# Altium schematic sheet MAIN_SCH.SchDoc
size A; Engineer: IBRAR AHMAD; Organization: REVIVE MEDICAL TECHNOLOGY; SheetNumber: 1; SheetTotal: 2; PROJECT: CTTM_V1.0
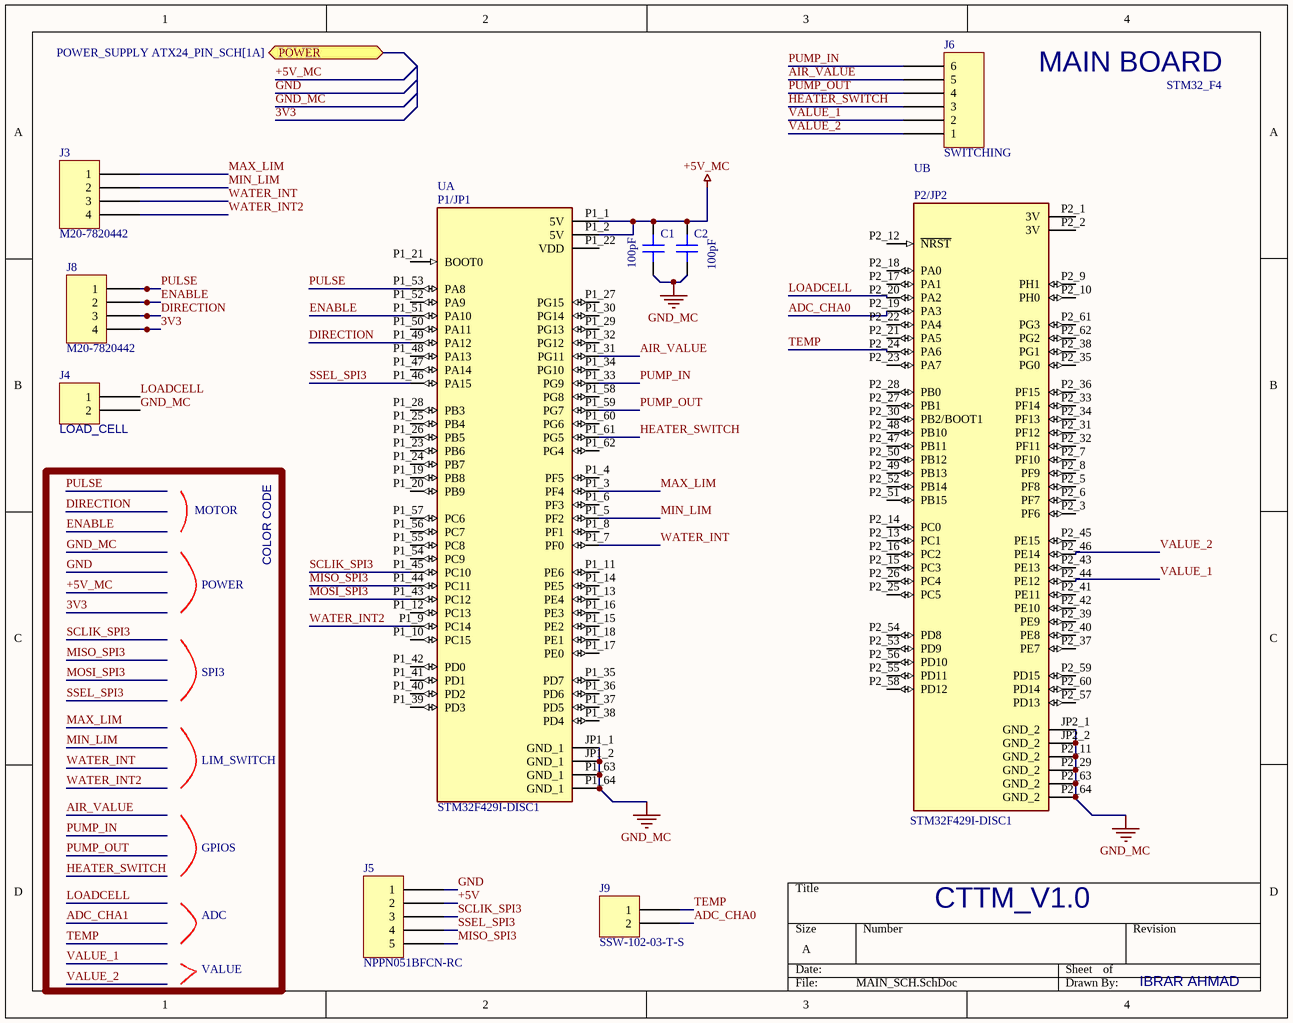
[diagram p0: MAIN_SCH.SchDoc]

## Parts
C1  100pF  [CAP 1206_3216 - 0.8MM]
C2  100pF  [CAP 1206_3216 - 0.8MM]
J3  M20-7820442  [HARWIN M20-7820445]
J4  LOAD_CELL  [SAMTEC SSW-102-03-T-S]
J5  NPPN051BFCN-RC  [SULLINS NPPN051BFCN]
J6  SWITCHING  [MOLEX KK 0022272061]
J8  M20-7820442  [HARWIN M20-7820445]
J9  SSW-102-03-T-S  [SAMTEC SSW-102-03-T-S]
U  STM32F429I-DISC1  [MODULE_STM32F429I-DISC1]  (parts A,B of 2)

## Ports
POWER (bidir, see POWER_SUPPLY ATX24_PIN_SCH[1A])

## Nets
+5V_MC: C1.2 C2.2 U.P1_1(5V) U.P1_2(5V)
GND_MC: C1.1 C2.1 J4.2 U.JP1_1(GND_1) U.JP1_2(GND_1) U.JP2_1(GND_2) U.JP2_2(GND_2) U.P1_63(GND_1) U.P1_64(GND_1) U.P2_11(GND_2) U.P2_29(GND_2) U.P2_63(GND_2) U.P2_64(GND_2)
3V3: J8.4
+5V: J5.2
ADC_CHA0: J9.2 U.P2_19(PA3)
AIR_VALUE: J6.5 U.P1_31(PG11)
DIRECTION: J8.3 U.P1_49(PA12)
ENABLE: J8.2 U.P1_51(PA10)
GND: J5.1
HEATER_SWITCH: J6.3 U.P1_61(PG5)
LOADCELL: J4.1 U.P2_20(PA2)
MAX_LIM: J3.1 U.P1_3(PF4)
MIN_LIM: J3.2 U.P1_5(PF2)
MISO_SPI3: J5.5 U.P1_44(PC11)
MOSI_SPI3: U.P1_43(PC12)
PULSE: J8.1 U.P1_53(PA8)
PUMP_IN: J6.6 U.P1_33(PG9)
PUMP_OUT: J6.4 U.P1_59(PG7)
SCLIK_SPI3: J5.3 U.P1_45(PC10)
SSEL_SPI3: J5.4 U.P1_46(PA15)
TEMP: J9.1 U.P2_24(PA6)
VALUE_1: J6.2 U.P2_44(PE12)
VALUE_2: J6.1 U.P2_46(PE14)
WATER_INT: J3.3 U.P1_7(PF0)
WATER_INT2: J3.4 U.P1_9(PC14)

Not connected (* = marked no-connect by the designer): U P1_4(PF5) P1_6(PF3) P1_8(PF1) P1_10(PC15) P1_11(PE6) P1_12(PC13) P1_13(PE4) P1_14(PE5) P1_15(PE2) P1_16(PE3) P1_17(PE0) P1_18(PE1) P1_19(PB8) P1_20(PB9) P1_21(BOOT0) P1_22(VDD) P1_23(PB6) P1_24(PB7) P1_25(PB4) P1_26(PB5) P1_27(PG15) P1_28(PB3) P1_29(PG13) P1_30(PG14) P1_32(PG12) P1_34(PG10) P1_35(PD7) P1_36(PD6) P1_37(PD5) P1_38(PD4) P1_39(PD3) P1_40(PD2) P1_41(PD1) P1_42(PD0) P1_47(PA14) P1_48(PA13) P1_50(PA11) P1_52(PA9) P1_54(PC9) P1_55(PC8) P1_56(PC7) P1_57(PC6) P1_58(PG8) P1_60(PG6) P1_62(PG4) P2_1(3V) P2_2(3V) P2_3(PF6) P2_5(PF8) P2_6(PF7) P2_7(PF10) P2_8(PF9) P2_9(PH1) P2_10(PH0) P2_12(~{NRST}) P2_13(PC1) P2_14(PC0) P2_15(PC3) P2_16(PC2) P2_17(PA1) P2_18(PA0) P2_21(PA5) P2_22(PA4) P2_23(PA7) P2_25(PC5) P2_26(PC4) P2_27(PB1) P2_28(PB0) P2_30(PB2/BOOT1) P2_31(PF12) P2_32(PF11) P2_33(PF14) P2_34(PF13) P2_35(PG0) P2_36(PF15) P2_37(PE7) P2_38(PG1) P2_39(PE9) P2_40(PE8) P2_41(PE11) P2_42(PE10) P2_43(PE13) P2_45(PE15) P2_47(PB11) P2_48(PB10) P2_49(PB13) P2_50(PB12) P2_51(PB15) P2_52(PB14) P2_53(PD9) P2_54(PD8) P2_55(PD11) P2_56(PD10) P2_57(PD13) P2_58(PD12) P2_59(PD15) P2_60(PD14) P2_61(PG3) P2_62(PG2)

## Notes on the sheet
- MAIN BOARD
- STM32_F4
- MOTOR
- COLOR CODE
- POWER
- SPI3
- LIM_SWITCH
- GPIOS
- ADC
- VALUE
- (in symbol STM32F429I-DISC1, part A) P1/JP1
- (in symbol STM32F429I-DISC1, part B) P2/JP2

## Library data of the parts
C1 C2 = MM061A101JCT2A: CAP CER 100PF 100V C0G/NP0 1206; manufacturer: AVX Corporation; Temperature Coefficient: C0G, NP0; Tolerance: ±5%; Part Number: MM061A101JCT2A; Value: 100pF; Applications: Medical, Non-Critical; Capacitance: 100pF; componentlink1description: Datasheet; componentlink1url: http://datasheets.avx.com/AVX-MM.pdf; componentlink2description: DigiKey Link; componentlink2url: http://digikey.com/product-detail/en/avx-corporation/MM061A101JCT2A/478-10622-1-ND/7344883; Device Package: 1206 (3216 Metric); lastupdated: 9/2/2020 1:04:46 AM; Lifecycle Status: Active; Minimum Order: 1; Mounting Type: Surface Mount, MLCC; Operating Temperature: -55°C ~ 125°C; Package / Case: 1206 (3216 Metric); packaging: TapeAndReel; partid: 18685; Part Status: Active; price: 0.52; series: MM; Size / Dimension: 0.126" L x 0.063" W (3.20mm x 1.60mm); Supplier 1: DigiKey; Supplier Part Number 1: 478-10622-1-ND; Thickness (Max): 0.029" (0.74mm); Voltage - Rated: 100V
J3 J8 = M20-7820442: CONN RCPT 4POS 0.1 GOLD PCB; Manufacturer: Harwin Inc.; Connector Type: Receptacle; Contact Length - Post: 0.118" (3.00mm); Current Rating (Amps): 3A; Mated Stacking Heights: 11.04mm, 12.63mm; Material Flammability Rating: UL94 V-0; Number of Positions: 4; Number of Positions Loaded: All; Pitch - Mating: 0.100" (2.54mm); Style: Board to Board or Cable; Part Number: M20-7820442; ComponentLink1Description: Datasheet; ComponentLink1URL: https://cdn.harwin.com/pdfs/Harwin_PC_Connectors_M20.pdf; ComponentLink2Description: DigiKey Link; ComponentLink2URL: https://www.digikey.com/en/products/detail/harwin-inc/M20-7820442/3727760; Contact Finish - Mating: Gold; Contact Finish - Post: Tin; Contact Finish Thickness - Mating: Flash; Contact Type: Female Socket; Fastening Type: Push-Pull; Insulation Color: Black; Insulation Height: 0.335" (8.51mm); LastUpdated: 9/21/2022 6:57:11 PM; Lifecycle Status: Active; Minimum Order: 1; Mounting Type: Through Hole; Number of Rows: 1; Operating Temperature: -40°C ~ 105°C; Packaging: Tube; Part Status: Active; Price: 0.45; Series: M20; Supplier 1: DigiKey; Supplier Part Number 1: 952-1791-ND; Termination: Solder
J4 J9 = SSW-102-03-T-S: CONN RCPT 2POS 0.1 TIN PCB; Manufacturer: Samtec Inc.; Connector Type: Receptacle; Current Rating (Amps): 5.7A per Contact; Material Flammability Rating: UL94 V-0; Number of Positions: 2; Number of Positions Loaded: All; Style: Board to Board or Cable; Part Number: SSW-102-03-T-S; ComponentLink2Description: DigiKey Link; ComponentLink2URL: http://digikey.com/product-detail/en/samtec-inc/SSW-102-03-T-S/SSW-102-03-T-S-ND/7873010; Contact Finish - Mating: Tin; Contact Finish - Post: Tin; Contact Type: Forked; Fastening Type: Push-Pull; Insulation Color: Black; LastUpdated: 6/21/2022 3:06:02 PM; Lifecycle Status: Active; Minimum Order: 1; Mounting Type: Through Hole; Number of Rows: 1; Operating Temperature: -55°C ~ 105°C; Packaging: Bulk; Part Status: Active; Price: 0.53; Series: SSW; Supplier 1: DigiKey; Supplier Part Number 1: SSW-102-03-T-S-ND; Termination: Solder
J5 = NPPN051BFCN-RC: CONN HDR 5POS 0.079 GOLD PCB; Manufacturer: Sullins Connector Solutions; Connector Type: Header; Contact Length - Post: 0.094" (2.40mm); Current Rating (Amps): 2A; Material Flammability Rating: UL94 V-0; Number of Positions: 5; Number of Positions Loaded: All; Pitch - Mating: 0.079" (2.00mm); Style: Board to Board; Part Number: NPPN051BFCN-RC; ComponentLink1Description: Datasheet; ComponentLink1URL: https://drawings-pdf.s3.amazonaws.com/10483.pdf; ComponentLink2Description: DigiKey Link; ComponentLink2URL: https://www.digikey.com/en/products/detail/sullins-connector-solutions/NPPN051BFCN-RC/804807; Contact Finish - Mating: Gold; Contact Finish - Post: Gold; Contact Finish Thickness - Mating: Flash; Contact Type: Female Socket; Fastening Type: Push-Pull; Insulation Color: Black; Insulation Height: 0.173" (4.40mm); LastUpdated: 6/21/2022 2:43:08 PM; Lifecycle Status: Active; Minimum Order: 1; Mounting Type: Through Hole; Number of Rows: 1; Operating Temperature: -40°C ~ 105°C; Packaging: Tube; Part Status: Active; Price: 0.35; Series: -; Supplier 1: DigiKey; Supplier Part Number 1: S5751-05-ND; Termination: Solder
J6 = 0022272061: CONN HEADER VERT 6POS 2.54MM; Manufacturer: Molex; Contact Length - Mating: 0.295" (7.49mm); Contact Length - Post: 0.140" (3.56mm); Material Flammability Rating: UL94 V-0; Number of Positions: 6; Number of Positions Loaded: All; Overall Contact Length: 0.560" (14.22mm); Pitch - Mating: 0.100" (2.54mm); Shrouding: Shrouded - 1 Wall; Style: Board to Cable/Wire; Part Number: 0022272061; ComponentLink1Description: Datasheet; ComponentLink1URL: https://www.molex.com/pdm_docs/sd/022272061_sd.pdf; ComponentLink2Description: DigiKey Link; ComponentLink2URL: http://digikey.com/product-detail/en/molex/0022272061/WM4115-ND/1130581; Connector Type: Header; Contact Finish - Mating: Tin; Contact Finish - Post: Tin; Contact Finish Thickness - Mating: 100.0µin (2.54µm); Contact Material: Brass; Contact Shape: Square; Contact Type: Male Pin; Fastening Type: Friction Lock; Insulation Color: Natural; Insulation Height: 0.461" (11.70mm); Insulation Material: Polyamide (PA), Nylon; LastUpdated: 1/12/2020 11:52:24 PM; Lifecycle Status: Active; Minimum Order: 1; Mounting Type: Through Hole; Number of Rows: 1; Packaging: Bulk; PartId: 80; Part Status: Active; Price: 0.49; Series: KK 6410; Supplier 1: DigiKey; Supplier Part Number 1: WM4115-ND; Termination: Solder
U = STM32F429I-DISC1: STM32F429 Discovery STM32F4 ARMÂ® CortexÂ®-M4 MCU 32-Bit Embedded Evaluation Board; MF: STMicroelectronics; SnapEDA_Link: https://www.snapeda.com/parts/STM32F429I-DISC1/STMicroelectronics/view-part/504905/?ref=snap; MP: STM32F429I-DISC1; Price: None; Value: *; Availability: Unavailable; Package: SOIC-14 STMicroelectronics